# Altium schematic sheet Diagrama_en_bloques.SchDoc
size A4
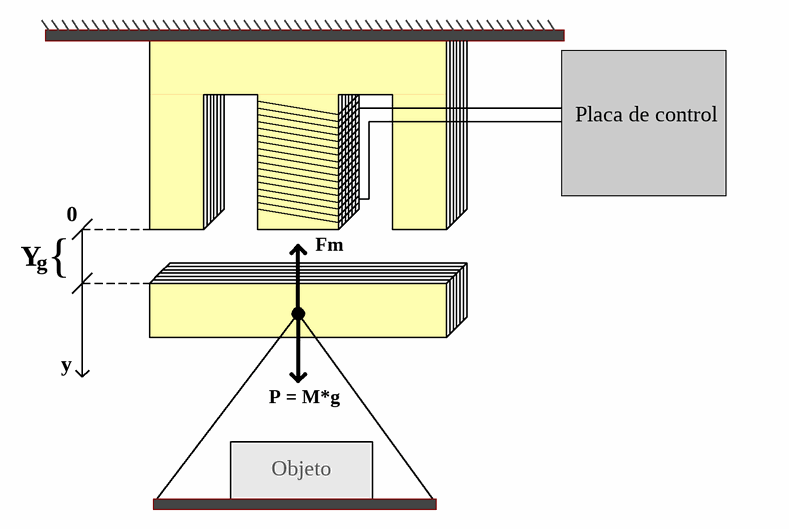
[diagram p0: Diagrama_en_bloques.SchDoc]

## Notes on the sheet
- Placa de control
- Y
- g
- {
- 0
- Fm
- y
- P = M*g
- Objeto